# Altium schematic sheet Sheet1.SchDoc
size A0; SheetNumber: 5; SheetTotal: 5
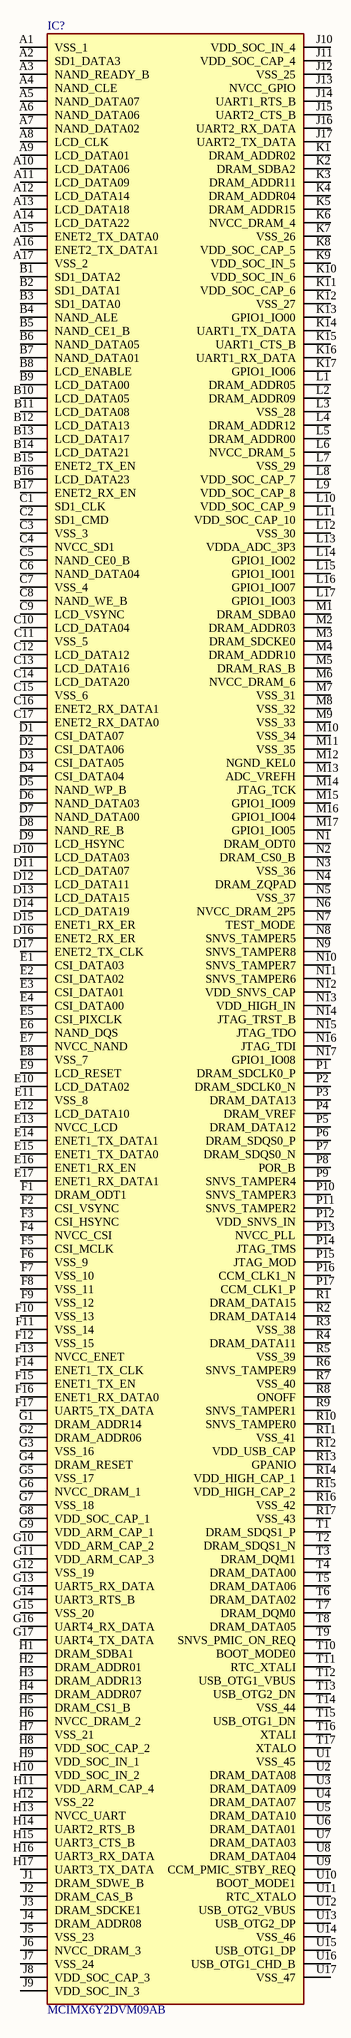
[diagram p0: Sheet1.SchDoc]

## Parts
IC?  MCIMX6Y2DVM09AB  [BGA289C80P17X17_1400X1400X132]

## Nets

Not connected (* = marked no-connect by the designer): IC? A1(VSS_1) A2(SD1_DATA3) A3(NAND_READY_B) A4(NAND_CLE) A5(NAND_DATA07) A6(NAND_DATA06) A7(NAND_DATA02) A8(LCD_CLK) A9(LCD_DATA01) A10(LCD_DATA06) A11(LCD_DATA09) A12(LCD_DATA14) A13(LCD_DATA18) A14(LCD_DATA22) A15(ENET2_TX_DATA0) A16(ENET2_TX_DATA1) A17(VSS_2) B1(SD1_DATA2) B2(SD1_DATA1) B3(SD1_DATA0) B4(NAND_ALE) B5(NAND_CE1_B) B6(NAND_DATA05) B7(NAND_DATA01) B8(LCD_ENABLE) B9(LCD_DATA00) B10(LCD_DATA05) B11(LCD_DATA08) B12(LCD_DATA13) B13(LCD_DATA17) B14(LCD_DATA21) B15(ENET2_TX_EN) B16(LCD_DATA23) B17(ENET2_RX_EN) C1(SD1_CLK) C2(SD1_CMD) C3(VSS_3) C4(NVCC_SD1) C5(NAND_CE0_B) C6(NAND_DATA04) C7(VSS_4) C8(NAND_WE_B) C9(LCD_VSYNC) C10(LCD_DATA04) C11(VSS_5) C12(LCD_DATA12) C13(LCD_DATA16) C14(LCD_DATA20) C15(VSS_6) C16(ENET2_RX_DATA1) C17(ENET2_RX_DATA0) D1(CSI_DATA07) D2(CSI_DATA06) D3(CSI_DATA05) D4(CSI_DATA04) D5(NAND_WP_B) D6(NAND_DATA03) D7(NAND_DATA00) D8(NAND_RE_B) D9(LCD_HSYNC) D10(LCD_DATA03) D11(LCD_DATA07) D12(LCD_DATA11) D13(LCD_DATA15) D14(LCD_DATA19) D15(ENET1_RX_ER) D16(ENET2_RX_ER) D17(ENET2_TX_CLK) E1(CSI_DATA03) E2(CSI_DATA02) E3(CSI_DATA01) E4(CSI_DATA00) E5(CSI_PIXCLK) E6(NAND_DQS) E7(NVCC_NAND) E8(VSS_7) E9(LCD_RESET) E10(LCD_DATA02) E11(VSS_8) E12(LCD_DATA10) E13(NVCC_LCD) E14(ENET1_TX_DATA1) E15(ENET1_TX_DATA0) E16(ENET1_RX_EN) E17(ENET1_RX_DATA1) F1(DRAM_ODT1) F2(CSI_VSYNC) F3(CSI_HSYNC) F4(NVCC_CSI) F5(CSI_MCLK) F6(VSS_9) F7(VSS_10) F8(VSS_11) F9(VSS_12) F10(VSS_13) F11(VSS_14) F12(VSS_15) F13(NVCC_ENET) F14(ENET1_TX_CLK) F15(ENET1_TX_EN) F16(ENET1_RX_DATA0) F17(UART5_TX_DATA) G1(DRAM_ADDR14) G2(DRAM_ADDR06) G3(VSS_16) G4(DRAM_RESET) G5(VSS_17) G6(NVCC_DRAM_1) G7(VSS_18) G8(VDD_SOC_CAP_1) G9(VDD_ARM_CAP_1) G10(VDD_ARM_CAP_2) G11(VDD_ARM_CAP_3) G12(VSS_19) G13(UART5_RX_DATA) G14(UART3_RTS_B) G15(VSS_20) G16(UART4_RX_DATA) G17(UART4_TX_DATA) H1(DRAM_SDBA1) H2(DRAM_ADDR01) H3(DRAM_ADDR13) H4(DRAM_ADDR07) H5(DRAM_CS1_B) H6(NVCC_DRAM_2) H7(VSS_21) H8(VDD_SOC_CAP_2) H9(VDD_SOC_IN_1) H10(VDD_SOC_IN_2) H11(VDD_ARM_CAP_4) H12(VSS_22) H13(NVCC_UART) H14(UART2_RTS_B) H15(UART3_CTS_B) H16(UART3_RX_DATA) H17(UART3_TX_DATA) J1(DRAM_SDWE_B) J2(DRAM_CAS_B) J3(DRAM_SDCKE1) J4(DRAM_ADDR08) J5(VSS_23) J6(NVCC_DRAM_3) J7(VSS_24) J8(VDD_SOC_CAP_3) J9(VDD_SOC_IN_3) J10(VDD_SOC_IN_4) J11(VDD_SOC_CAP_4) J12(VSS_25) J13(NVCC_GPIO) J14(UART1_RTS_B) J15(UART2_CTS_B) J16(UART2_RX_DATA) J17(UART2_TX_DATA) K1(DRAM_ADDR02) K2(DRAM_SDBA2) K3(DRAM_ADDR11) K4(DRAM_ADDR04) K5(DRAM_ADDR15) K6(NVCC_DRAM_4) K7(VSS_26) K8(VDD_SOC_CAP_5) K9(VDD_SOC_IN_5) K10(VDD_SOC_IN_6) K11(VDD_SOC_CAP_6) K12(VSS_27) K13(GPIO1_IO00) K14(UART1_TX_DATA) K15(UART1_CTS_B) K16(UART1_RX_DATA) K17(GPIO1_IO06) L1(DRAM_ADDR05) L2(DRAM_ADDR09) L3(VSS_28) L4(DRAM_ADDR12) L5(DRAM_ADDR00) L6(NVCC_DRAM_5) L7(VSS_29) L8(VDD_SOC_CAP_7) L9(VDD_SOC_CAP_8) L10(VDD_SOC_CAP_9) L11(VDD_SOC_CAP_10) L12(VSS_30) L13(VDDA_ADC_3P3) L14(GPIO1_IO02) L15(GPIO1_IO01) L16(GPIO1_IO07) L17(GPIO1_IO03) M1(DRAM_SDBA0) M2(DRAM_ADDR03) M3(DRAM_SDCKE0) M4(DRAM_ADDR10) M5(DRAM_RAS_B) M6(NVCC_DRAM_6) M7(VSS_31) M8(VSS_32) M9(VSS_33) M10(VSS_34) M11(VSS_35) M12(NGND_KEL0) M13(ADC_VREFH) M14(JTAG_TCK) M15(GPIO1_IO09) M16(GPIO1_IO04) M17(GPIO1_IO05) N1(DRAM_ODT0) N2(DRAM_CS0_B) N3(VSS_36) N4(DRAM_ZQPAD) N5(VSS_37) N6(NVCC_DRAM_2P5) N7(TEST_MODE) N8(SNVS_TAMPER5) N9(SNVS_TAMPER8) N10(SNVS_TAMPER7) N11(SNVS_TAMPER6) N12(VDD_SNVS_CAP) N13(VDD_HIGH_IN) N14(JTAG_TRST_B) N15(JTAG_TDO) N16(JTAG_TDI) N17(GPIO1_IO08) P1(DRAM_SDCLK0_P) P2(DRAM_SDCLK0_N) P3(DRAM_DATA13) P4(DRAM_VREF) P5(DRAM_DATA12) P6(DRAM_SDQS0_P) P7(DRAM_SDQS0_N) P8(POR_B) P9(SNVS_TAMPER4) P10(SNVS_TAMPER3) P11(SNVS_TAMPER2) P12(VDD_SNVS_IN) P13(NVCC_PLL) P14(JTAG_TMS) P15(JTAG_MOD) P16(CCM_CLK1_N) P17(CCM_CLK1_P) R1(DRAM_DATA15) R2(DRAM_DATA14) R3(VSS_38) R4(DRAM_DATA11) R5(VSS_39) R6(SNVS_TAMPER9) R7(VSS_40) R8(ONOFF) R9(SNVS_TAMPER1) R10(SNVS_TAMPER0) R11(VSS_41) R12(VDD_USB_CAP) R13(GPANIO) R14(VDD_HIGH_CAP_1) R15(VDD_HIGH_CAP_2) R16(VSS_42) R17(VSS_43) T1(DRAM_SDQS1_P) T2(DRAM_SDQS1_N) T3(DRAM_DQM1) T4(DRAM_DATA00) T5(DRAM_DATA06) T6(DRAM_DATA02) T7(DRAM_DQM0) T8(DRAM_DATA05) T9(SNVS_PMIC_ON_REQ) T10(BOOT_MODE0) T11(RTC_XTALI) T12(USB_OTG1_VBUS) T13(USB_OTG2_DN) T14(VSS_44) T15(USB_OTG1_DN) T16(XTALI) T17(XTALO) U1(VSS_45) U2(DRAM_DATA08) U3(DRAM_DATA09) U4(DRAM_DATA07) U5(DRAM_DATA10) U6(DRAM_DATA01) U7(DRAM_DATA03) U8(DRAM_DATA04) U9(CCM_PMIC_STBY_REQ) U10(BOOT_MODE1) U11(RTC_XTALO) U12(USB_OTG2_VBUS) U13(USB_OTG2_DP) U14(VSS_46) U15(USB_OTG1_DP) U16(USB_OTG1_CHD_B) U17(VSS_47)

## Library data of the parts
IC? = MCIMX6Y2DVM09AB: Integrated Circuit; Manufacturer_Name: NXP; Datasheet Link: http://www.nxp.com/docs/en/data-sheet/IMX6ULLCEC.pdf; Height: 1.32mm; Manufacturer_Part_Number: MCIMX6Y2DVM09AB; Mouser Part Number: 771-MCIMX6Y2DVM09AB; Mouser Price/Stock: https://www.mouser.co.uk/ProductDetail/NXP-Semiconductors/MCIMX6Y2DVM09AB/?qs=1mbolxNpo8dLZCzHiBeiHw%3D%3D; Arrow Part Number: MCIMX6Y2DVM09AB; Arrow Price/Stock: https://www.arrow.com/en/products/mcimx6y2dvm09ab/nxp-semiconductors